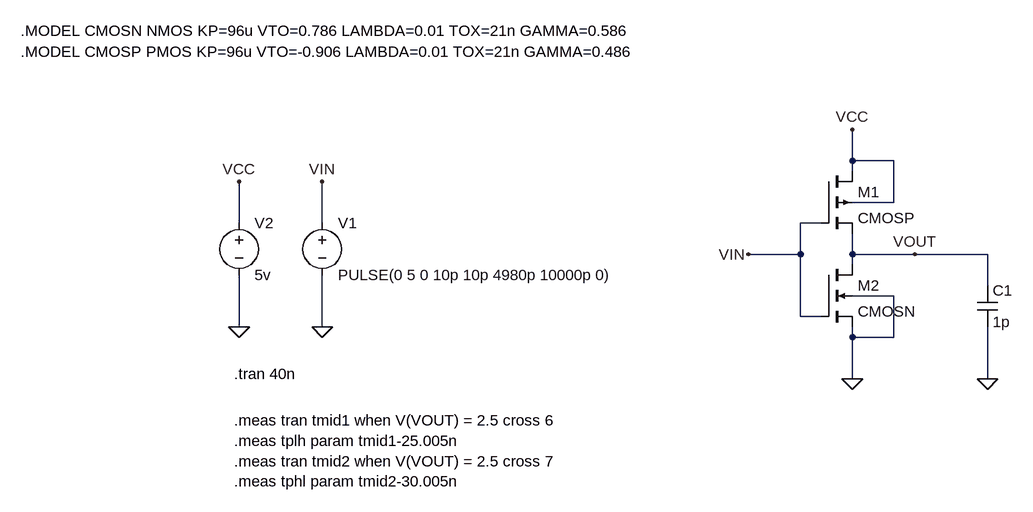
[diagram p0: schematic CMOS inverter.asc]
CMOS inverter.asc, the LTspice schematic file:
Version 4
SHEET 1 2500 932
WIRE 560 64 560 16
WIRE 624 64 560 64
WIRE 560 80 560 64
WIRE 624 128 624 64
WIRE 624 128 560 128
WIRE -384 160 -384 96
WIRE -256 160 -256 96
WIRE 512 160 480 160
WIRE 480 208 480 160
WIRE 480 208 400 208
WIRE 560 208 560 176
WIRE 656 208 560 208
WIRE 768 208 656 208
WIRE 560 224 560 208
WIRE 768 256 768 208
WIRE 624 272 560 272
WIRE 480 304 480 208
WIRE 512 304 480 304
WIRE -384 320 -384 240
WIRE -256 320 -256 240
WIRE 560 336 560 320
WIRE 624 336 624 272
WIRE 624 336 560 336
WIRE 560 400 560 336
WIRE 768 400 768 320
FLAG -256 320 0
FLAG -256 96 VIN
FLAG 560 400 0
FLAG 560 16 VCC
FLAG -384 320 0
FLAG -384 96 VCC
FLAG 400 208 VIN
FLAG 656 208 VOUT
FLAG 768 400 0
SYMBOL pmos4 512 80 R0
SYMATTR InstName M1
SYMATTR Value CMOSP
SYMATTR Value2 l=10u w=100u
SYMBOL nmos4 512 224 R0
SYMATTR InstName M2
SYMATTR Value CMOSN
SYMATTR Value2 l=10u w=100u
SYMBOL voltage -256 144 R0
WINDOW 123 0 0 Left 0
WINDOW 39 0 0 Left 0
SYMATTR InstName V1
SYMATTR Value PULSE(0 5 0 10p 10p 4980p 10000p 0)
SYMBOL voltage -384 144 R0
WINDOW 123 0 0 Left 0
WINDOW 39 0 0 Left 0
SYMATTR InstName V2
SYMATTR Value 5v
SYMBOL cap 752 256 R0
SYMATTR InstName C1
SYMATTR Value 1p
TEXT -720 -136 Left 2 !.MODEL CMOSN NMOS KP=96u VTO=0.786 LAMBDA=0.01 TOX=21n GAMMA=0.586
TEXT -720 -104 Left 2 !.MODEL CMOSP PMOS KP=96u VTO=-0.906 LAMBDA=0.01 TOX=21n GAMMA=0.486
TEXT -392 392 Left 2 !.tran 40n
TEXT -392 464 Left 2 !.meas tran tmid1 when V(VOUT) = 2.5 cross 6\n.meas tplh param tmid1-25.005n\n.meas tran tmid2 when V(VOUT) = 2.5 cross 7\n.meas tphl param tmid2-30.005n

The netlist it stands for:
* CMOS inverter.asc
M1 VCC VIN VOUT VCC CMOSP l=10u w=100u
M2 VOUT VIN 0 0 CMOSN l=10u w=100u
V1 VIN 0 PULSE(0 5 0 10p 10p 4980p 10000p 0)
V2 VCC 0 5v
C1 VOUT 0 1p
.model NMOS NMOS
.model PMOS PMOS
.lib standard.mos
.MODEL CMOSN NMOS KP=96u VTO=0.786 LAMBDA=0.01 TOX=21n GAMMA=0.586
.MODEL CMOSP PMOS KP=96u VTO=-0.906 LAMBDA=0.01 TOX=21n GAMMA=0.486
.tran 40n
.meas tran tmid1 when V(VOUT) = 2.5 cross 6
.meas tplh param tmid1-25.005n
.meas tran tmid2 when V(VOUT) = 2.5 cross 7
.meas tphl param tmid2-30.005n
.backanno
.end

* Results of the author's LTspice run, read from the files saved beside the schematic
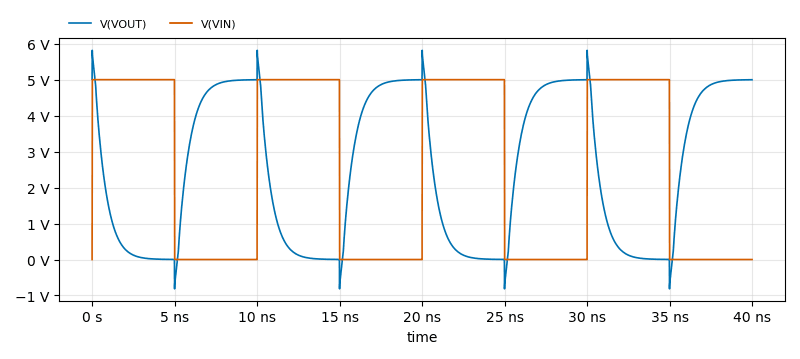
[diagram p1: Transient Analysis of CMOS inverter.asc, plotted from the saved traces]
* Transient Analysis, 1 run:
*   V(VOUT): min -814.3 mV, max 5.814 V, average 2.485 V, rms 3.298 V, last 4.998 V
*   V(VIN): min 0 V, max 5 V, average 2.495 V, rms 3.531 V, last 0 V
* From the log:
*   tmid1: v(vout)=2.5 AT 2.56801e-08
*   tplh: tmid1-25.005n=6.751e-10
*   tmid2: v(vout)=2.5 AT 3.06558e-08
*   tphl: tmid2-30.005n=6.50782e-10